# EAGLE design adns9500 (EAGLE 5.06)
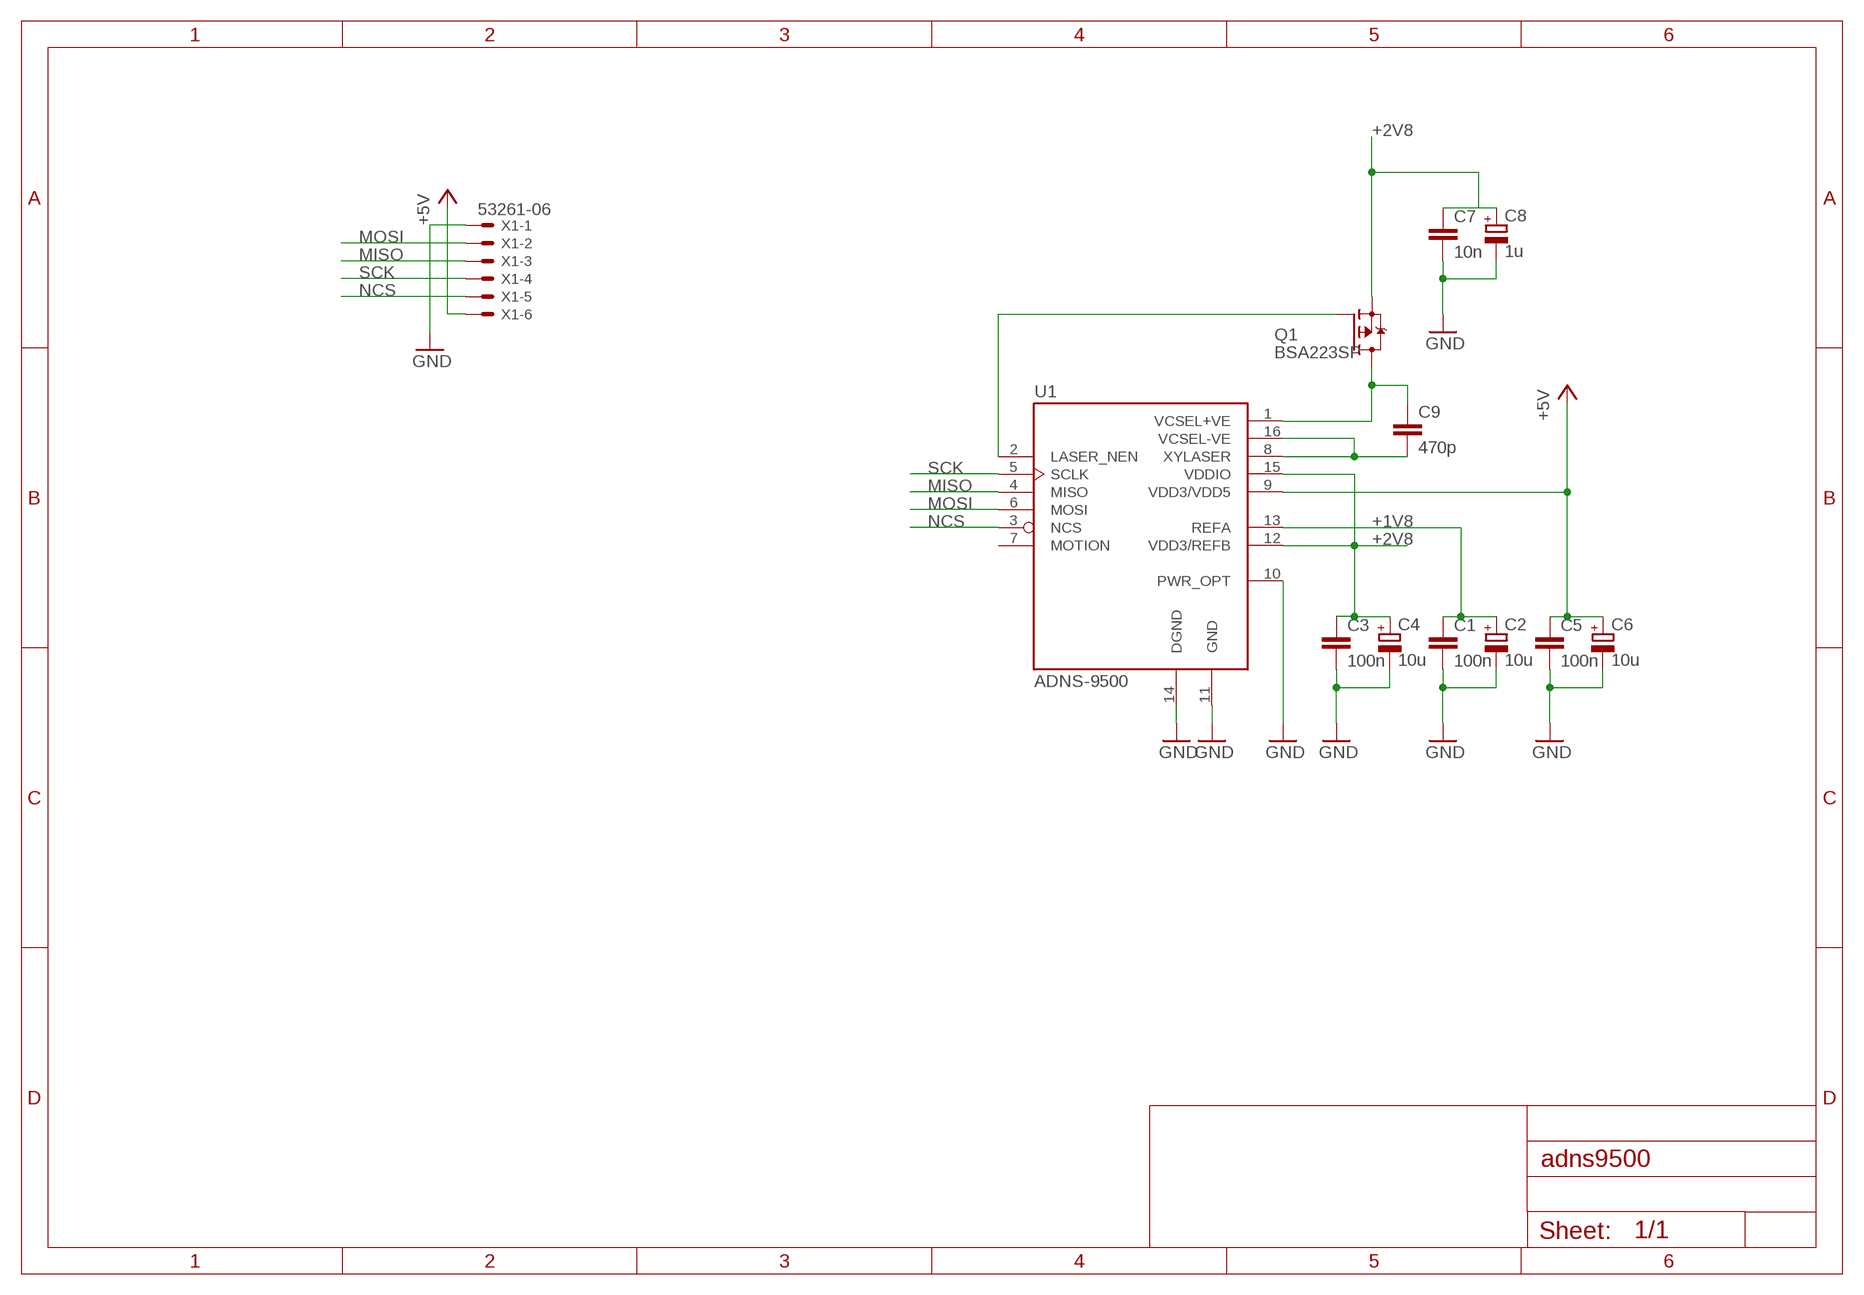
[diagram p0: schematic, sheet 1]

## Parts
C1  100n  C-EUC0603  [C0603]
C2  10u  CPOL-EUA/3216-18R  [A/3216-18R]
C3  100n  C-EUC0603  [C0603]
C4  10u  CPOL-EUA/3216-18R  [A/3216-18R]
C5  100n  C-EUC0603  [C0603]
C6  10u  CPOL-EUA/3216-18R  [A/3216-18R]
C7  10n  C-EUC0603  [C0603]
C8  1u  CPOL-EUA/3216-18R  [A/3216-18R]
C9  470p  C-EUC0603  [C0603]
Q1  BSA223SP  [SC75_INFINEON]
U1  ADNS-9500  [ADNS-9500-PB]
X1  53261-06  [53261-06]

## Nets
+1V8: C1.1 C2.+ U1.13(REFA)
+2V8: C3.1 C4.+ C7.1 C8.+ Q1.3(S) U1.12(VDD3/REFB) U1.15(VDDIO)
+5V: C5.1 C6.+ U1.9(VDD3/VDD5) X1.6
GND: C1.2 C2.- C3.2 C4.- C5.2 C6.- C7.2 C8.- U1.10(PWR_OPT) U1.11(GND) U1.14(DGND) X1.1
MISO: U1.4(MISO) X1.3
MOSI: U1.6(MOSI) X1.2
N$1: C9.2 U1.8(XYLASER) U1.16(VCSEL-VE)
N$3: C9.1 Q1.2(D) U1.1(VCSEL+VE)
N$4: Q1.1(G) U1.2(LASER_NEN)
NCS: U1.3(NCS) X1.5
SCK: U1.5(SCLK) X1.4
Unconnected: U1.7(MOTION)

## Library data of the parts
C1 C3 C5 C7 C9 = resistor:C-EU: CAPACITOR, European symbol
C2 C4 C6 C8 = resistor:CPOL-EU: POLARIZED CAPACITOR, European symbol
Q1 = transistor-fet:BSA223SP: OptiMOS(R)-P Small-Signal-Transistor P-Channel, Enhancement mode, Super Logic Level (2.5 V rated) Source: http://www.infineon.com/upload/Document/BSA223SP_Rev1.3.pdf
U1 = adns9500:ADNS-9500
X1 = con-molex:53?-06: CONNECTOR wire to board 1.25 mm (.049 inch) pitch header

## Board
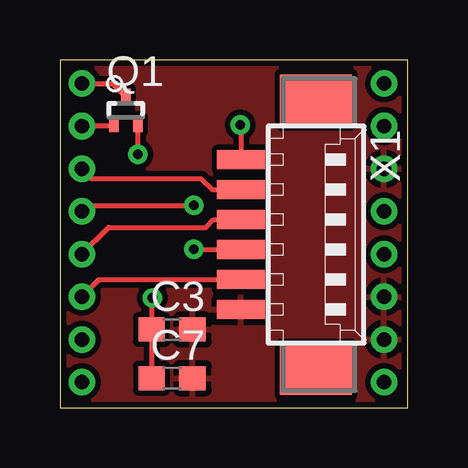
[diagram p1: board, top side]
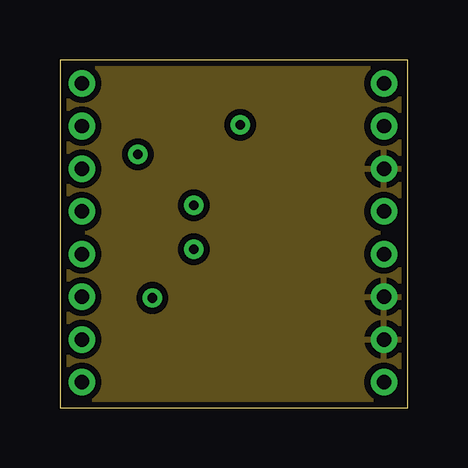
[diagram p2: board, inner layer Route2]
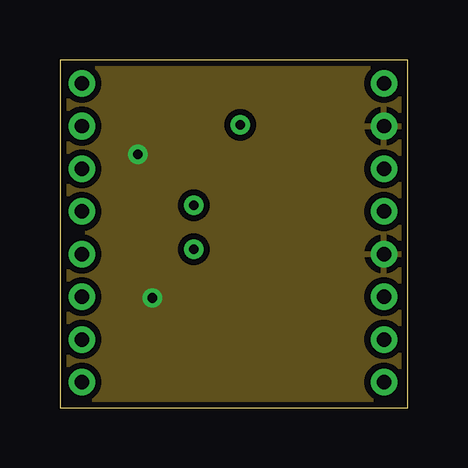
[diagram p3: board, inner layer Route15]
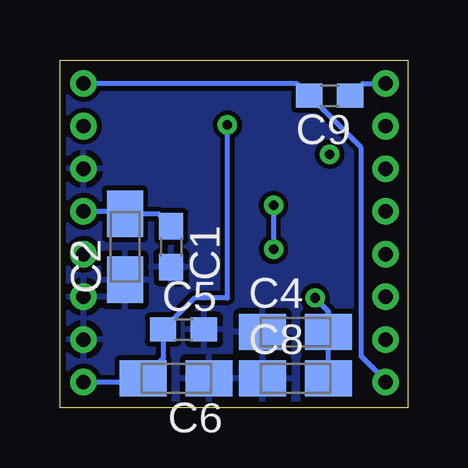
[diagram p4: board, bottom side, seen from below]

Size 14.5 x 14.5 mm. Coordinates in mm from the lower left corner, seen from the top.
Outline: 0,0 14.5,0 14.5,14.5 0,14.5 0,0
Copper layers (1*2+15*16): Top 0.035mm / dielectric 0.4mm / Route2 0.035mm / dielectric 0.04mm / Route15 0.035mm / dielectric 0.4mm / Bottom 0.035mm
Design rules "default *": minimum track width 8mil, minimum drill 0.4mm, track to track 8mil, track to pad 8mil, pad to pad 8mil, via to via 8mil, smd to smd 8mil, copper to edge 10mil, drill to drill 8mil, minimum pad ring 10mil, minimum via ring 8mil, stop-mask expansion 4mil, vias tented up to drill 0.4mm, thermal gap 10mil

### Footprints (pad centres in the part's own frame; a part is rotated, then mirrored left to right if it is on the bottom)
C0603 = smd 1.1 x 1: 1 -0.85,0; 2 0.85,0
A/3216-18R = smd 1.95 x 1.5: + 1.375,0; - -1.375,0
SC75_INFINEON = smd 0.4 x 0.65: 1 -0.5,-0.575; 2 0,0.575; 3 0.5,-0.575
ADNS-9500-PB = drill 0.6 pad 1 round: 1 7.12,6.3; 2 5.34,6.3; 3 3.56,6.3; 4 1.78,6.3; 5 0,6.3; 6 -1.78,6.3; 7 -3.56,6.3; 8 -5.34,6.3; 9 -5.34,-6.3; 10 -3.56,-6.3; 11 -1.78,-6.3; 12 0,-6.3; 13 1.78,-6.3; 14 3.56,-6.3; 15 5.34,-6.3; 16 7.12,-6.3
53261-06 = smd 0.8 x 2: 1 3.125,-2.5; 2 1.875,-2.5; 3 0.625,-2.5; 4 -0.625,-2.5; 5 -1.875,-2.5; 6 -3.125,-2.5 | smd 2.1 x 3: S1 5.625,0.625; S2 -5.625,0.625

### Placement (x,y rotation side)
C1  9.86,6.71 270 bottom
C2  11.79,6.71 90 bottom
C3  4.67,3.25 0 top
C4  4.67,3.15 0 bottom
C5  9.35,3.25 0 bottom
C6  9.65,1.22 180 bottom
C7  4.67,1.22 0 top
C8  4.67,1.22 0 bottom
C9  3.25,13 180 bottom
Q1  2.74,12.4 0 top
U1  7.21,6.4 90 top
X1  10.06,7.21 270 top

### Tracks (layer width: path | path; a pad name or v marks a point on that pad's centre or on a via)
+1V8
  Bottom 0.203: C1.1 10.38,8.08 C2.+ 11.89,8.18 U1.13
+2V8  (via drill 0.4)
  Top 0.203: C7.1 C3.1 3.82,4.54 v3.86,4.57 | v3.25,10.57 v3.24,10.57 Q1.3
  Bottom 0.203: v3.86,4.57 3.3,4.01 C4.+ C8.+
  pour Route15 (isolate 0.254): 0,14.5 14.5,14.5 14.5,0 0,0
+5V  (via drill 0.4)
  Top 0.203: v7.52,11.79 7.56,11.75 X1.6
  Bottom 0.203: U1.9 11.19,1.06 C6.+ 10.2,2.05 C5.1 8.88,4.57 7.52,4.57 v7.52,11.79
GND
  pour Route2 (isolate 0.254): 0,14.5 14.5,14.5 14.5,0 0,0
  pour Top (isolate 0.229): 0,14.5 14.5,14.5 14.5,0 0,0
  pour Bottom (isolate 0.203): 0,14.5 14.5,14.5 14.5,0 0,0
MISO  (via drill 0.4)
  Top 0.203: X1.3 5.6,6.59 v5.59,6.6 | v5.59,8.43 1.17,8.43 U1.4
  Bottom 0.203: v5.59,8.43 v5.59,6.6
MOSI
  Top 0.203: X1.2 1.63,5.34 U1.6
N$1
  Bottom 0.203: U1.16 4.62,13.52 C9.2 1.93,10.83 1.93,2.13 0.91,1.12 U1.8
N$3
  Top 0.203: Q1.2 2.19,13.52 U1.1
  Bottom 0.203: C9.1 1.89,13.52 U1.1
N$4
  Top 0.203: Q1.1 2.16,11.74 U1.2
NCS
  Top 0.203: X1.5 6.36,9.09 5.89,9.55 1.32,9.55 U1.3
SCK
  Top 0.203: X1.4 6.42,7.84 6.1,7.52 2.03,7.52 U1.5